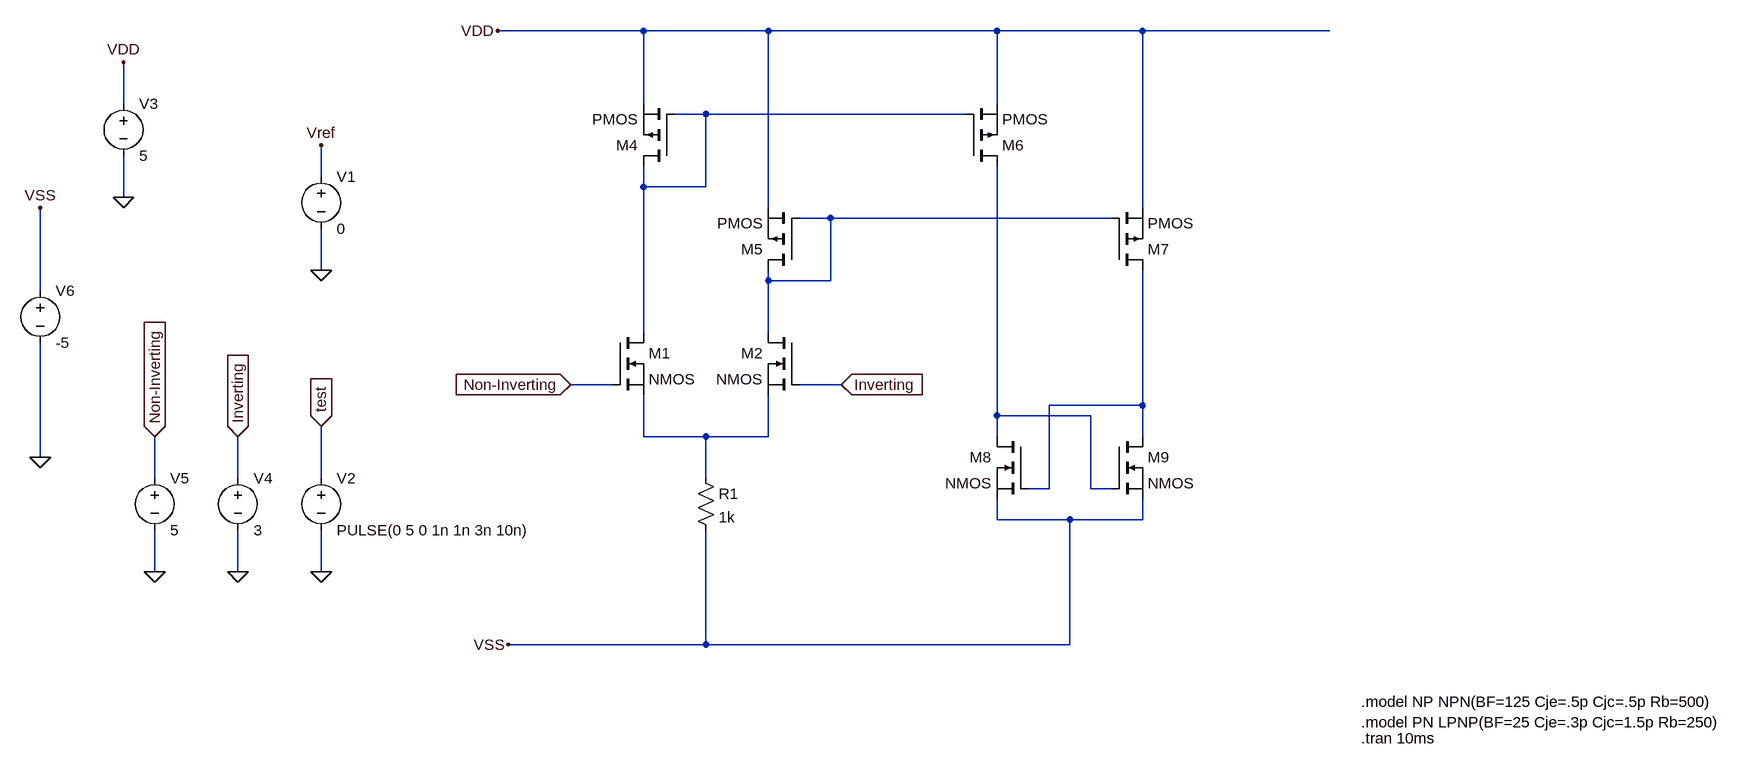
[diagram p0: schematic m_Comparator_VLSI_TestDision.asc]
m_Comparator_VLSI_TestDision.asc, the LTspice schematic file:
Version 4
SHEET 1 2064 800
WIRE 128 -304 -96 -304
WIRE 320 -304 128 -304
WIRE 672 -304 320 -304
WIRE 896 -304 672 -304
WIRE 1184 -304 896 -304
WIRE -672 -192 -672 -256
WIRE 128 -192 128 -304
WIRE 672 -192 672 -304
WIRE 224 -176 176 -176
WIRE 624 -176 224 -176
WIRE -368 -80 -368 -128
WIRE 128 -64 128 -96
WIRE 224 -64 224 -176
WIRE 224 -64 128 -64
WIRE -672 -48 -672 -112
WIRE 320 -32 320 -304
WIRE 896 -32 896 -304
WIRE 416 -16 368 -16
WIRE 848 -16 416 -16
WIRE -368 64 -368 0
WIRE 320 80 320 64
WIRE 416 80 416 -16
WIRE 416 80 320 80
WIRE -800 96 -800 -32
WIRE 128 160 128 -64
WIRE 320 160 320 80
WIRE 80 240 16 240
WIRE 432 240 368 240
WIRE 896 272 896 64
WIRE 896 272 752 272
WIRE 672 288 672 -96
WIRE 816 288 672 288
WIRE 128 320 128 256
WIRE 224 320 128 320
WIRE 320 320 320 256
WIRE 320 320 224 320
WIRE 672 320 672 288
WIRE 896 320 896 272
WIRE -800 352 -800 176
WIRE -624 384 -624 320
WIRE -496 384 -496 320
WIRE -368 384 -368 304
WIRE 224 384 224 320
WIRE 752 400 752 272
WIRE 752 400 720 400
WIRE 816 400 816 288
WIRE 848 400 816 400
WIRE 672 448 672 416
WIRE 784 448 672 448
WIRE 896 448 896 416
WIRE 896 448 784 448
WIRE -624 528 -624 464
WIRE -496 528 -496 464
WIRE -368 528 -368 464
WIRE 224 640 224 464
WIRE 224 640 -80 640
WIRE 784 640 784 448
WIRE 784 640 224 640
FLAG -368 -128 Vref
FLAG -368 64 0
FLAG 16 240 Non-Inverting
IOPIN 16 240 In
FLAG 432 240 Inverting
IOPIN 432 240 In
FLAG -800 352 0
FLAG -672 -256 VDD
FLAG -96 -304 VDD
FLAG -496 528 0
FLAG -624 528 0
FLAG -624 320 Non-Inverting
IOPIN -624 320 In
FLAG -496 320 Inverting
IOPIN -496 320 In
FLAG -800 -32 VSS
FLAG -80 640 VSS
FLAG -368 304 test
IOPIN -368 304 In
FLAG -368 528 0
FLAG -672 -48 0
SYMBOL nmos 80 160 R0
SYMATTR InstName M1
SYMBOL nmos 368 160 M0
SYMATTR InstName M2
SYMBOL voltage -368 -96 R0
WINDOW 123 0 0 Left 0
WINDOW 39 0 0 Left 0
SYMATTR InstName V1
SYMATTR Value 0
SYMBOL pmos 176 -96 R180
SYMATTR InstName M4
SYMBOL pmos 368 64 R180
SYMATTR InstName M5
SYMBOL pmos 624 -96 M180
SYMATTR InstName M6
SYMBOL pmos 848 64 M180
SYMATTR InstName M7
SYMBOL voltage -672 -208 R0
SYMATTR InstName V3
SYMATTR Value 5
SYMBOL nmos 720 320 M0
SYMATTR InstName M8
SYMBOL nmos 848 320 R0
SYMATTR InstName M9
SYMBOL voltage -496 368 R0
WINDOW 123 0 0 Left 0
WINDOW 39 0 0 Left 0
SYMATTR InstName V4
SYMATTR Value 3
SYMBOL voltage -624 368 R0
SYMATTR InstName V5
SYMATTR Value 5
SYMBOL voltage -800 80 R0
SYMATTR InstName V6
SYMATTR Value -5
SYMBOL res 208 368 R0
SYMATTR InstName R1
SYMATTR Value 1k
SYMBOL voltage -368 368 R0
WINDOW 123 0 0 Left 0
WINDOW 39 0 0 Left 0
SYMATTR InstName V2
SYMATTR Value PULSE(0 5 0 1n 1n 3n 10n)
TEXT 1232 728 Left 2 !.model NP NPN(BF=125 Cje=.5p Cjc=.5p Rb=500)\n.model PN LPNP(BF=25 Cje=.3p Cjc=1.5p Rb=250)
TEXT 1232 784 Left 2 !.tran 10ms

The netlist it stands for:
* m_Comparator_VLSI_TestDision.asc
M1 N001 Non-Inverting N005 N005 NMOS
M2 N002 Inverting N005 N005 NMOS
V1 Vref 0 0
M4 N001 N001 VDD VDD PMOS
M5 N002 N002 VDD VDD PMOS
M6 N004 N001 VDD VDD PMOS
M7 N003 N002 VDD VDD PMOS
V3 VDD 0 5
M8 N004 N003 VSS VSS NMOS
M9 N003 N004 VSS VSS NMOS
V4 Inverting 0 3
V5 Non-Inverting 0 5
V6 VSS 0 -5
R1 N005 VSS 1k
V2 test 0 PULSE(0 5 0 1n 1n 3n 10n)
.model NMOS NMOS
.model PMOS PMOS
.lib standard.mos
.model NP NPN(BF=125 Cje=.5p Cjc=.5p Rb=500)
.model PN LPNP(BF=25 Cje=.3p Cjc=1.5p Rb=250)
.tran 10ms
.backanno
.end